# EAGLE design LaptopCounter (EAGLE 9.4.0)
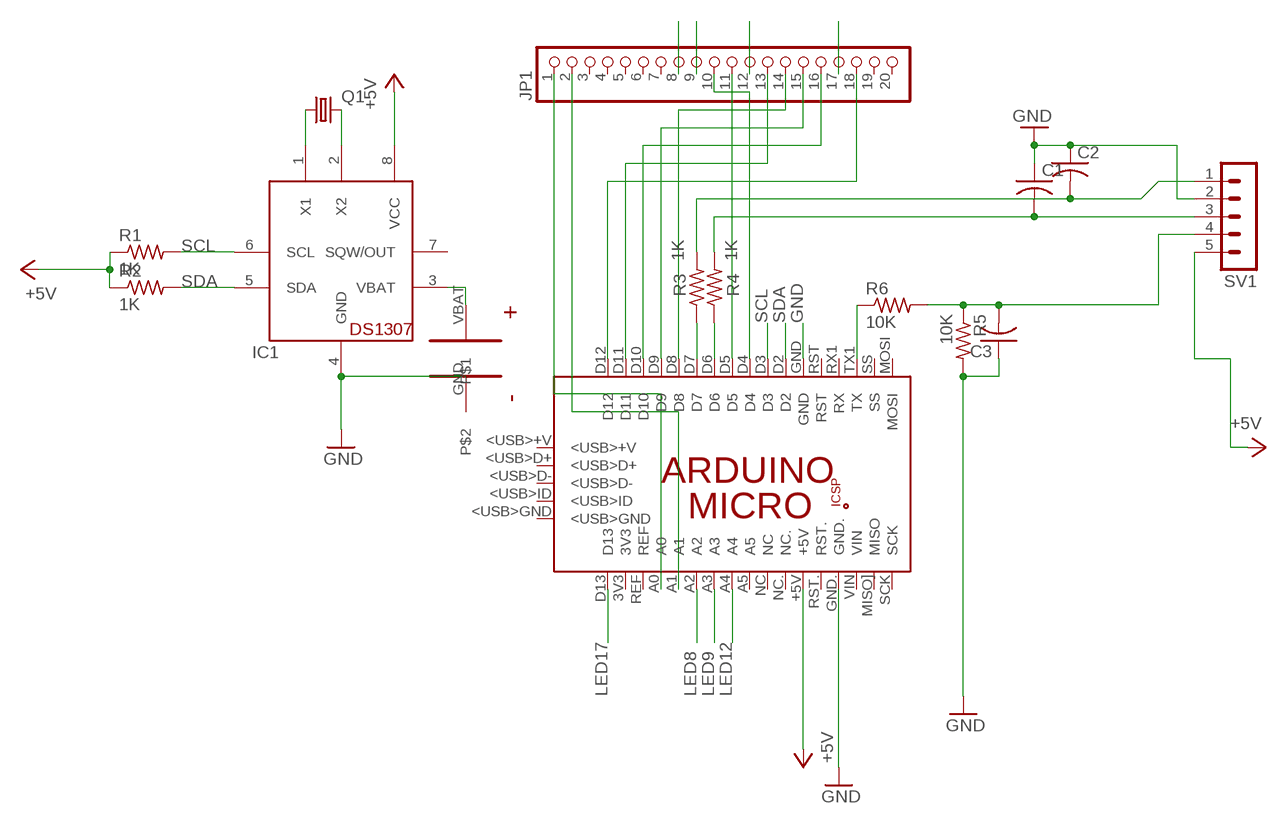
[diagram p0: schematic, sheet 1]

## Parts
C1  C-US025-024X044  [C025-024X044]
C2  C-US025-024X044  [C025-024X044]
C3  C-US025-024X044  [C025-024X044]
IC1  DS1307  [DIL08]
JP1  PINHD-1X20  [1X20]
PCB1  ARDUINO_MICRO  [ARDUINO_MICRO]
Q1  CRYSTALTC26H  [TC26H]
R1  1K  R-US_0207/10  [0207/10]
R2  1K  R-US_0207/10  [0207/10]
R3  1K  R-US_0207/10  [0207/10]
R4  1K  R-US_0207/10  [0207/10]
R5  10K  R-US_0207/10  [0207/10]
R6  10K  R-US_0207/10  [0207/10]
SV1  MA05-1  [MA05-1]
U$1  CR2032  [2PIN_TH]

## Nets
+5V: IC1.8(VCC) PCB1.+5V R1.1 R2.1 SV1.5
GND: C1.1 C2.1 C3.1 IC1.4(GND) PCB1.GND PCB1.GND. R5.2 SV1.2 U$1.GND
LED8: JP1.8 PCB1.A2
LED9: JP1.9 PCB1.A3
LED12: JP1.12 PCB1.A4
LED17: JP1.17 PCB1.D13
N$1: IC1.1(X1) Q1.1
N$2: IC1.2(X2) Q1.2
N$3: PCB1.D6 R4.1
N$4: PCB1.D7 R3.1
N$5: C1.2 R4.2 SV1.3
N$6: C2.2 R3.2 SV1.1
N$7: JP1.18 PCB1.D12
N$8: JP1.13 PCB1.D11
N$9: JP1.16 PCB1.D10
N$10: JP1.15 PCB1.D9
N$11: JP1.14 PCB1.D8
N$12: JP1.11 PCB1.D5
N$13: JP1.10 PCB1.D4
N$14: PCB1.TX1(TX) R6.1
N$15: C3.2 R5.1 R6.2 SV1.4
N$16: JP1.1 PCB1.A0
N$17: JP1.2 PCB1.A1
N$18: IC1.3(VBAT) U$1.VBAT
SCL: IC1.6(SCL) PCB1.D3 R1.2
SDA: IC1.5(SDA) PCB1.D2 R2.2
Unconnected: IC1.7(SQW/OUT) JP1.3 JP1.4 JP1.5 JP1.6 JP1.7 JP1.19 JP1.20 PCB1.3V3 PCB1.5V PCB1.<USB>+V PCB1.<USB>D+ PCB1.<USB>D- PCB1.<USB>GND PCB1.<USB>ID PCB1.A5 PCB1.GND_ PCB1.MISO. PCB1.MISO](MISO) PCB1.MOSI PCB1.MOSI. PCB1.NC PCB1.NC. PCB1.REF PCB1.RESET.. PCB1.RST PCB1.RST. PCB1.RX1(RX) PCB1.SCK PCB1.SCK. PCB1.SS PCB1.VIN

## Library data of the parts
C1-C3 = rcl:C-US: CAPACITOR, American symbol; SPICEPREFIX: C
IC1 = adafruit:DS1307: DS1307 Real time clock (RTC) with battery backup ability. Talk to it via i2c
JP1 = adafruit:PINHD-1X20: PIN HEADER
PCB1 = E14_Arduino_revC:ARDUINO_MICRO: Device for representing an Arduino Micro board with a footprint in an EAGLE design. Created by Dave Young for Element14. More EAGLE documentation at: http://www.element14.com/community/community/knode/cadsoft_eagle
Q1 = adafruit:CRYSTAL: CRYSTAL; OC_FARNELL: unknown; OC_NEWARK: unknown
R1-R6 = rcl:R-US_: RESISTOR, American symbol; SPICEPREFIX: R
SV1 = con-lstb:MA05-1: PIN HEADER; OC_FARNELL: unknown; OC_NEWARK: unknown
U$1 = Personal:CR2032

## Board
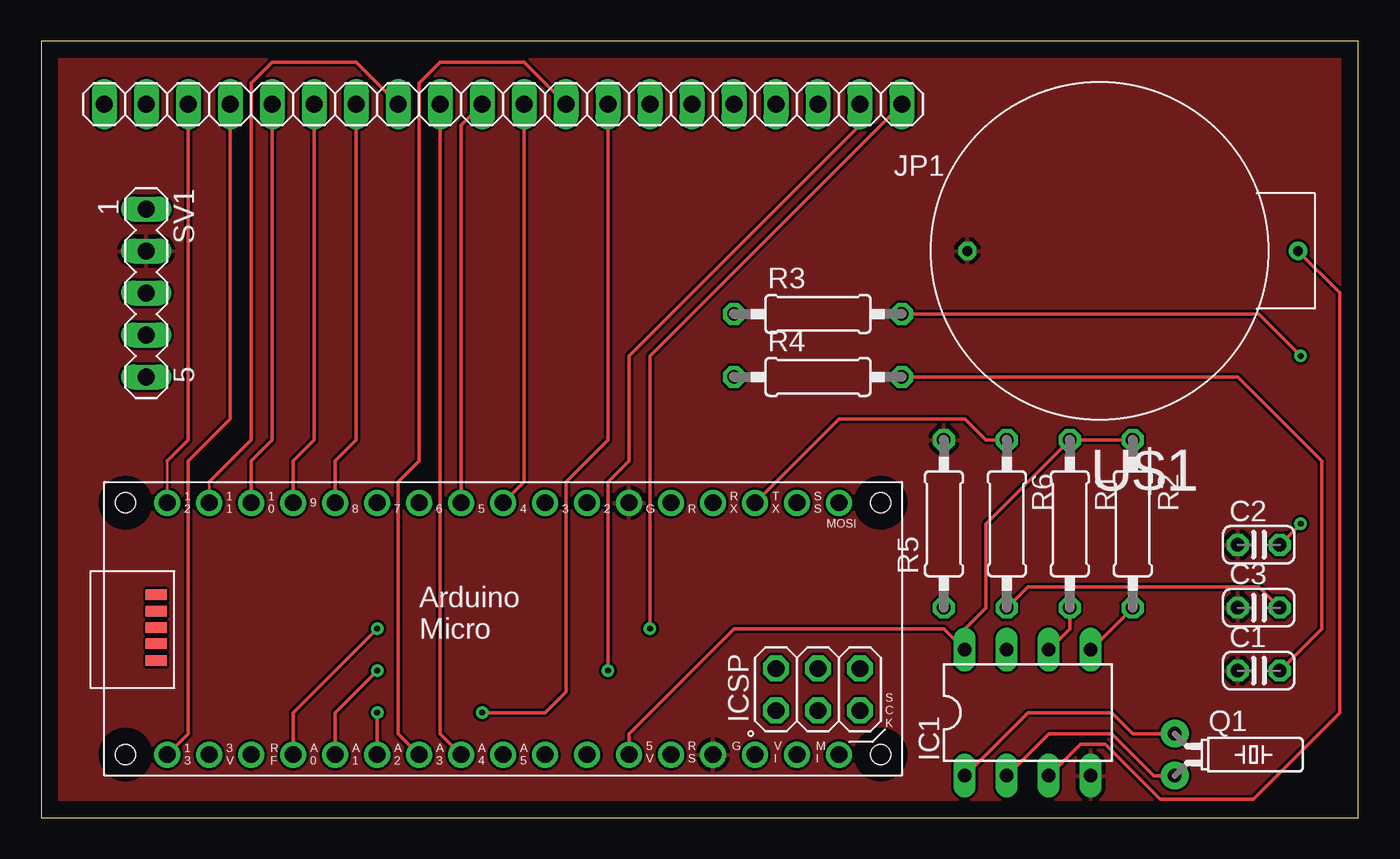
[diagram p1: board, top side]
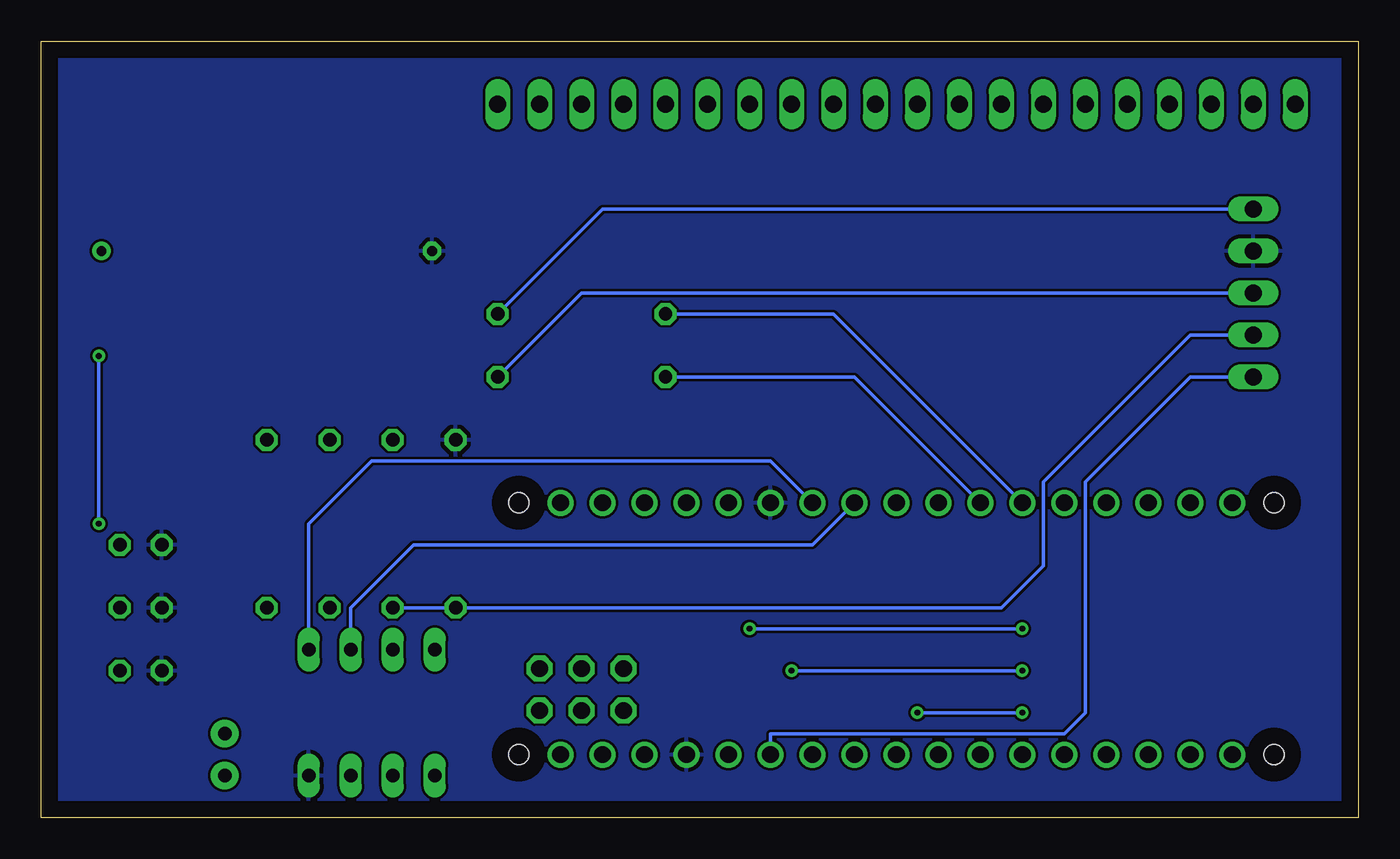
[diagram p2: board, bottom side, seen from below]

Size 79.68 x 46.98 mm. Coordinates in mm from the lower left corner, seen from the top.
Outline: 0,0 79.68,0 79.68,46.98 0,46.98 0,0
Copper layers (1*16): Top 0.035mm / dielectric 1.5mm / Bottom 0.035mm
Design rules "default": minimum track width 6mil, minimum drill 0.35mm, track to track 6mil, track to pad 6mil, pad to pad 6mil, via to via 6mil, smd to smd 6mil, copper to edge 40mil, drill to drill 6mil, minimum pad ring 10mil, minimum via ring 8mil, stop-mask expansion 4mil, vias tented up to drill 0mil, thermal gap 10mil

### Footprints (pad centres in the part's own frame; a part is rotated, then mirrored left to right if it is on the bottom)
C025-024X044 = drill 0.813 octagon: 1 -1.27,0; 2 1.27,0
DIL08 = drill 0.813 long: 1 -3.81,-3.81; 2 -1.27,-3.81; 3 1.27,-3.81; 4 3.81,-3.81; 5 3.81,3.81; 6 1.27,3.81; 7 -1.27,3.81; 8 -3.81,3.81
1X20 = drill 1.016 long: 1 -24.13,0; 2 -21.59,0; 3 -19.05,0; 4 -16.51,0; 5 -13.97,0; 6 -11.43,0; 7 -8.89,0; 8 -6.35,0; 9 -3.81,0; 10 -1.27,0; 11 1.27,0; 12 3.81,0; 13 6.35,0; 14 8.89,0; 15 11.43,0; 16 13.97,0; 17 16.51,0; 18 19.05,0; 19 21.59,0; 20 24.13,0
ARDUINO_MICRO = drill 1.016 pad 1.575: 3V3 6.35,1.27; +5V 31.75,1.27; A0 11.43,1.27; A1 13.97,1.27; A2 16.51,1.27; A3 19.05,1.27; A4 21.59,1.27; A5 24.13,1.27; D2 29.21,16.51; D3 26.67,16.51; D4 24.13,16.51; D5 21.59,16.51; D6 19.05,16.51; D7 16.51,16.51; D8 13.97,16.51; D9 11.43,16.51; D10 8.89,16.51; D11 6.35,16.51; D12 3.81,16.51; D13 3.81,1.27; GND 31.75,16.51; GND. 36.83,1.27; MISO] 41.91,1.27; MOSI 44.45,16.51; NC 26.67,1.27; NC. 29.21,1.27; REF 8.89,1.27; RST 34.29,16.51; RST. 34.29,1.27; RX1 36.83,16.51; SCK 44.45,1.27; SS 41.91,16.51; TX1 39.37,16.51; VIN 39.37,1.27 | drill 1.016 pad 1.575 octagon: 5V 40.64,6.477; GND_ 45.72,6.477; MISO. 40.64,3.937; MOSI. 43.18,6.477; RESET.. 45.72,3.937; SCK. 43.18,3.937 | smd 1.27 x 0.635: <USB>+V 3.15,10.947; <USB>D+ 3.15,9.957; <USB>D- 3.15,8.941; <USB>GND 3.15,6.96; <USB>ID 3.15,7.976 | hole 1.2: 1.27,1.27; 1.27,16.51; 46.99,16.51; 46.99,1.27
TC26H = drill 0.813 pad 1.676: 1 -1.27,0; 2 1.27,0
0207/10 = drill 0.813 octagon: 1 -5.08,0; 2 5.08,0
MA05-1 = drill 1.016 long: 1 -5.08,0; 2 -2.54,0; 3 0,0; 4 2.54,0; 5 5.08,0
2PIN_TH = drill 0.6 octagon: GND 10,0 | drill 0.6: VBAT -10,0

### Placement (x,y rotation side)
C1  73.66,8.89 0 top
C2  73.66,16.51 0 top
C3  73.66,12.7 0 top
IC1  59.69,6.35 0 top
JP1  27.94,43.18 180 top
PCB1  3.81,2.54 0 top
Q1  68.58,3.81 270 top
R1  62.23,17.78 270 top
R2  66.04,17.78 270 top
R3  46.99,30.48 0 top
R4  46.99,26.67 0 top
R5  54.61,17.78 90 top
R6  58.42,17.78 270 top
SV1  6.35,31.75 270 top
U$1  66.04,34.29 180 top

### Tracks (layer width: path | path; a pad name or v marks a point on that pad's centre or on a via)
+5V
  Top 0.203: R2.1 R1.1 57.15,17.78 57.15,12.7 55.88,11.43 IC1.8 54.61,11.43 41.91,11.43 35.56,5.08 PCB1.+5V
  Bottom 0.203: SV1.5 10.16,26.67 16.51,20.32 16.51,6.35 17.78,5.08 35.56,5.08 PCB1.+5V
GND
  pour Top: -1.27,48.26 -1.27,-1.27 82.55,-1.27 82.55,48.26
  pour Bottom: -1.27,48.26 -1.27,-1.27 80.01,-1.27 80.01,48.26
LED8  (via drill 0.35)
  Top 0.203: JP1.8 34.29,22.86 31.75,20.32 31.75,7.62 30.48,6.35 v26.67,6.35 | PCB1.A2 v20.32,6.35
  Bottom 0.203: v26.67,6.35 v20.32,6.35
LED9
  Top 0.203: JP1.9 29.21,45.72 24.13,45.72 22.86,44.45 22.86,21.59 21.59,20.32 21.59,5.08 PCB1.A3
LED12
  Top 0.203: JP1.12 24.13,5.08 PCB1.A4
LED17
  Top 0.203: JP1.17 11.43,24.13 8.89,21.59 8.89,5.08 PCB1.D13
N$1
  Top 0.203: Q1.1 66.04,5.08 64.77,6.35 59.69,6.35 IC1.1
N$2
  Top 0.203: Q1.2 67.31,2.54 64.77,5.08 60.96,5.08 IC1.2
N$3
  Bottom 0.203: PCB1.D6 30.48,26.67 R4.1
N$4
  Bottom 0.203: PCB1.D7 31.75,30.48 R3.1
N$5
  Top 0.203: R4.2 72.39,26.67 77.47,21.59 77.47,11.43 C1.2
  Bottom 0.203: SV1.3 46.99,31.75 R4.2
N$6  (via drill 0.35)
  Top 0.203: C2.2 v76.2,17.78 | R3.2 73.66,30.48 v76.2,27.94
  Bottom 0.203: v76.2,27.94 v76.2,17.78 | SV1.1 45.72,36.83 R3.2
N$7
  Top 0.152: 7.62,21.59 PCB1.D12
  Top 0.203: JP1.18 8.89,22.86 7.62,21.59
N$8
  Top 0.152: 10.16,20.32 PCB1.D11
  Top 0.203: JP1.13 19.05,45.72 13.97,45.72 12.7,44.45 12.7,22.86 10.16,20.32
N$9
  Top 0.203: JP1.16 13.97,22.86 12.7,21.59 PCB1.D10
N$10
  Top 0.203: JP1.15 16.51,22.86 15.24,21.59 PCB1.D9
N$11
  Top 0.203: JP1.14 19.05,22.86 17.78,21.59 PCB1.D8
N$12
  Top 0.203: PCB1.D5 25.4,41.91 JP1.11
N$13
  Top 0.203: JP1.10 29.21,20.32 PCB1.D4
N$14
  Top 0.203: R6.1 57.15,22.86 55.88,24.13 48.26,24.13 PCB1.TX1
N$15
  Top 0.203: C3.2 73.66,13.97 59.69,13.97 R6.2
  Bottom 0.203: R6.2 R5.1 21.59,12.7 19.05,15.24 19.05,20.32 10.16,29.21 SV1.4
N$16  (via drill 0.35)
  Top 0.203: JP1.1 36.83,27.94 v36.83,11.43 | PCB1.A0 15.24,6.35 v20.32,11.43
  Bottom 0.203: v36.83,11.43 v20.32,11.43
N$17  (via drill 0.35)
  Top 0.203: JP1.2 49.53,41.91 35.56,27.94 35.56,21.59 34.29,20.32 v34.29,8.89 | PCB1.A1 17.78,6.35 v20.32,8.89
  Bottom 0.203: v20.32,8.89 v34.29,8.89
N$18
  Top 0.203: U$1.VBAT 78.56,31.77 78.56,6.35 73.33,1.12 67.72,1.12 64.39,4.45 62.87,4.45 IC1.3
SCL
  Top 0.203: R1.2 62.23,11.43 IC1.6
  Bottom 0.203: IC1.6 60.96,12.7 57.15,16.51 33.02,16.51 PCB1.D3
SDA
  Top 0.203: R2.2 IC1.5
  Bottom 0.203: IC1.5 63.5,17.78 59.69,21.59 35.56,21.59 PCB1.D2